# Altium schematic sheet SCHE_BUZZ.SchDoc
size A; DocumentNumber: 1; SheetNumber: 1; SheetTotal: 1
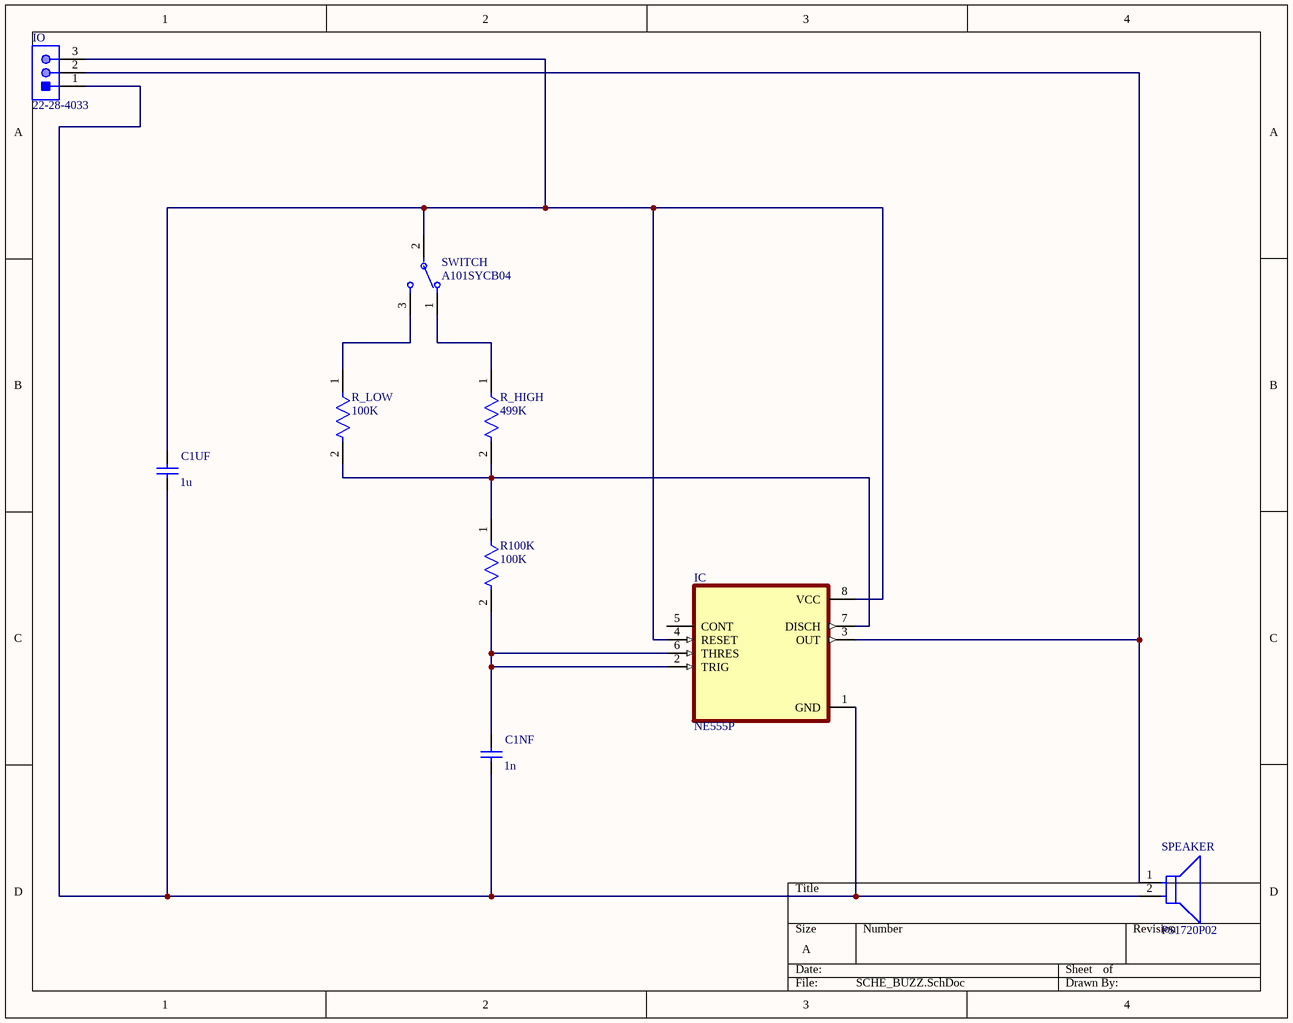
[diagram p0: SCHE_BUZZ.SchDoc]

## Parts
C1NF  1n  [KEMT-C330C105M5U5TA]
C1UF  1u  [KEMT-C330C105M5U5TA]
IC  NE555P  [DIP794W45P254L959H508Q8]
IO  22-28-4033  [MOLX-22-28-4033_V]
R100K  100K  [FP-AC05000003909JAC00-0]
R_HIGH  499K  [FP-AC05000003909JAC00-0]
R_LOW  100K  [FP-AC05000003909JAC00-0]
SPEAKER  PS1720P02  [FP-PS1720P02-MFG]
SWITCH  A101SYCB04  [FP-A101SYCB04-MFG]

## Nets
NetC1NF_1: C1NF.1 IC.2(TRIG) IC.6(THRES) R100K.2
NetC1NF_2: C1NF.2 C1UF.2 IC.1(GND) IO.1 SPEAKER.2
NetC1UF_1: C1UF.1 IC.4(RESET) IC.8(VCC) IO.3 SWITCH.2
NetIC_3: IC.3(OUT) IO.2 SPEAKER.1
NetIC_7: IC.7(DISCH) R100K.1 R_HIGH.2 R_LOW.2
NetR_HIGH_1: R_HIGH.1 SWITCH.1
NetR_LOW_1: R_LOW.1 SWITCH.3

Not connected (* = marked no-connect by the designer): IC 5(CONT)

## Library data of the parts
C1NF C1UF = CMP-2000-06056-1: Ceramic Capacitor, 1 uF, +/- 20%, 50 V, -10 to 85 degC, 2-Pin THD, RoHS, Bulk; Manufacturer: Kemet; Voltage - Rated: 50V; Temperature Coefficient: Z5U; Catalog Drawings: C330(std); Product Training Modules: CapacitorBasics-TypicalUsesforCapacitors; Capacitance: 1µF; Online Catalog: GoldenMax™Series; Other Names: 399-4390; PCN Design/Specification: C3yySeriesGoldenMaxLeadConfiguration02/Feb/2015; Thickness (Max): -; Size / Dimension: 0.300"Lx0.150"W(7.62mmx3.81mm); Mounting Technology: ThroughHole; Tolerance: ±20%; Mounting Type: ThroughHole; Datasheet URL: http://www.kemet.com/Lists/ProductCatalog/Attachments/599/KEM_C1051_GOLDMAX_Z5U.pdf; Series: GoldenMax™; Standard Package: 250; Ratings: -; Applications: GeneralPurpose; Package Reference: C330C105M5U5TA; Packaging: Bulk; Category: Capacitors; Package Description: 2-Pin Through Hole Device, Body 7.11 x 4.07 mm; Operating Temperature: 10°C~85°C; Height - Seated (Max): 0.360"(9.14mm); Manufacturer URL: http://www.kemet.com/; Lead Spacing: 0.200"(5.08mm); Features: -; Lead Style: Straight; Package / Case: Radial; Family: CeramicCapacitors; Datasheet Version: 12/2015
IO = CMP-1676-00001-5: Male Header, Pitch 2.54 mm, 1 x 3 Position, Height 8.38 mm, Tail Length 3.18 mm, RoHS, Bulk; Manufacturer: Molex; Rows: 1; Voltage Rating: 250 V; Current Rating: 4 A; Min Operating Temperature: 0 degC; Lead Pitch: 0.1 inch; Packaging: Bulk; Contact Finish: Gold; RoHSCompliant: true; Contact Material: Brass; PackageReference: 22-28-4033; REACH SVHC: Unknown; PackageDescription: Male Header, Pitch 2.54 mm, 1 x 3 Position, Height 8.38 mm, Tail Length 3.18 mm; ComponentLink2URL: http://www.molex.com/pdm_docs/sd/022284033_sd.pdf; Height: 8.38 mm; Mounting Technology: Through Hole; ComponentLink1Description: Manufacturer URL; Length: 7.62 mm; Mount: Through Hole; DatasheetVersion: Rev. G, 01/2012; Max Operating Temperature: 75 degC; ComponentLink2Description: Datasheet; Colour: Black; Pins: 3; Contact Plating: Gold; Package Quantity: 1; ComponentLink1URL: http://www.molex.com/
R100K R_HIGH R_LOW = CMP-02408-000001-1: Manufacturer: Vishay; Manufacturer Part Number: AC05000003909JAC00; Tolerance: 5%; Power Rating: 5W; Value: 39Ω; Automotive Grade: NA; Device Class L2: Resistors; Automotive: No; Device Class L3: Through-Hole Resistors; Lead Free: Yes; Octopart: https://octopart.com/ac05000003909jac00-vishay-39746279; Temperature Range High: +250°C; Package: 0; Category: Res; Digikey Description: RES 39 OHM 5W 5% AXIAL; RoHS: TRUE; Height: 7.5mm; Mouser Description: Res Wirewound 39 Ohm 5% 5W -80ppm/°C to -10ppm/°C Conformal AXL Thru-Hole Ammo Pack; Resistance: 39Ω; Temperature: -55°C to +250°C; Device Class L1: Passive Components; ComponentLink2URL: http://www.vishay.com/docs/28730/acac-at.pdf; Composition: Wirewound; ComponentLink2Description: Datasheet; Temperature Range Low: -55°C; Series: AC; Ipc Land Pattern Name: RESAD2166W100L1800D750
SPEAKER = CMP-08413-000001-1: AUDIO PIEZO TRANSDUCER 30V TH; Manufacturer: TDK Corporation; Frequency: 2kHz; Standoff Height: 0.5mm; RoHS: TRUE; ComponentLink2URL: https://product.tdk.com/info/en/catalog/datasheets/piezoelectronic_buzzer_ps_en.pdf; ComponentLink2Description: Datasheet; Lead Free: Yes; Temperature Range High: +70°C; Category: Speak; Height: 8.3mm; Device Class L1: Electromechanical; Device Class L3: Buzzers; Package: 0; Mouser Description: Audio Indicators & Alerts Round 17mmx8mm 2 kHz Vin=3V; Manufacturer Part Number: PS1720P02; Digikey Description: AUDIO PIEZO TRANSDUCER 30V TH; Device Class L2: Audio Products; Temperature Range Low: -10°C; Automotive: No; Octopart: https://octopart.com/ps1720p02-tdk-154429; Temperature: -10°C to +70°C
SWITCH = CMP-03408-000017-1: SWITCH TOGGLE SPDT 0.4VA 20V; Electrical Life: 6000Cycles; Number of Poles: 1; Power Rating: 400mW; Switch Function: On-On; Contact Resistance: 10mR; Contact Current Rating: 400mA; Actuator Material: Phenolic; Insulation Resistance: 30MR; Actuator Color: Chrome; Number of Positions: 2; Actuator Type: Standard Round; Actuator Length: 10.41mm; Illumination Type: Non-Illuminated; Flammability Rating: UL94 V-1; Contact Material: Copper; Depth: 6.86mm; Contact Plating: Gold; Voltage Rating (AC): 20V; Max Voltage Rating (DC): 20V; Min Operating Temperature: -30°C; Max Operating Temperature: 85°C; Throw Configuration: SPDT; Packaging: Bulk; Termination: PC Pins; Series: Gemini A; ELV: Compliant; Lead Free: Lead Free; RoHS Compliant: Yes; REACH SVHC: No SVHC; Mount: Panel; Orientation: Straight; Package Quantity: 100; Max Voltage Rating (AC): 20V; Radiation Hardening: No; Voltage Rating (DC): 20V
IC = NE555P: Price: None; Package: None; Availability: Unavailable; MP: NE555P; Value: *